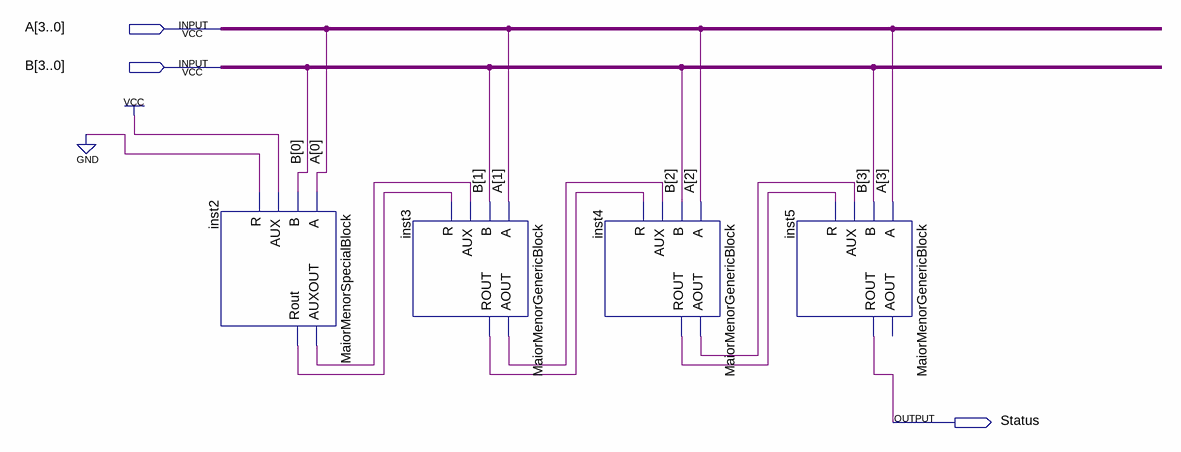
[diagram p0: schematic sheet]
// Quartus schematic MaiorMenorFuction.bdf as structural Verilog: 4 symbols, 3 pins
module MaiorMenorFuction (
  input  [3:0] A,
  input  [3:0] B,
  output Status
);

  wire inst2_auxout, inst2_rout, inst3_aout, inst3_rout, inst4_aout, inst4_rout;

  MaiorMenorSpecialBlock inst2 (.A(A[0]), .B(B[0]), .AUX(1'b1), .R(1'b0), .AUXOUT(inst2_auxout), .Rout(inst2_rout));
  MaiorMenorGenericBlock inst3 (
    .A(A[1]), .B(B[1]), .AUX(inst2_auxout), .R(inst2_rout), .AOUT(inst3_aout), .ROUT(inst3_rout));
  MaiorMenorGenericBlock inst4 (
    .A(A[2]), .B(B[2]), .AUX(inst3_aout), .R(inst3_rout), .AOUT(inst4_aout), .ROUT(inst4_rout));
  MaiorMenorGenericBlock inst5 (.A(A[3]), .B(B[3]), .AUX(inst4_aout), .R(inst4_rout), .ROUT(Status));  // open: AOUT
endmodule
